# EAGLE design RX (EAGLE 7.3.0)
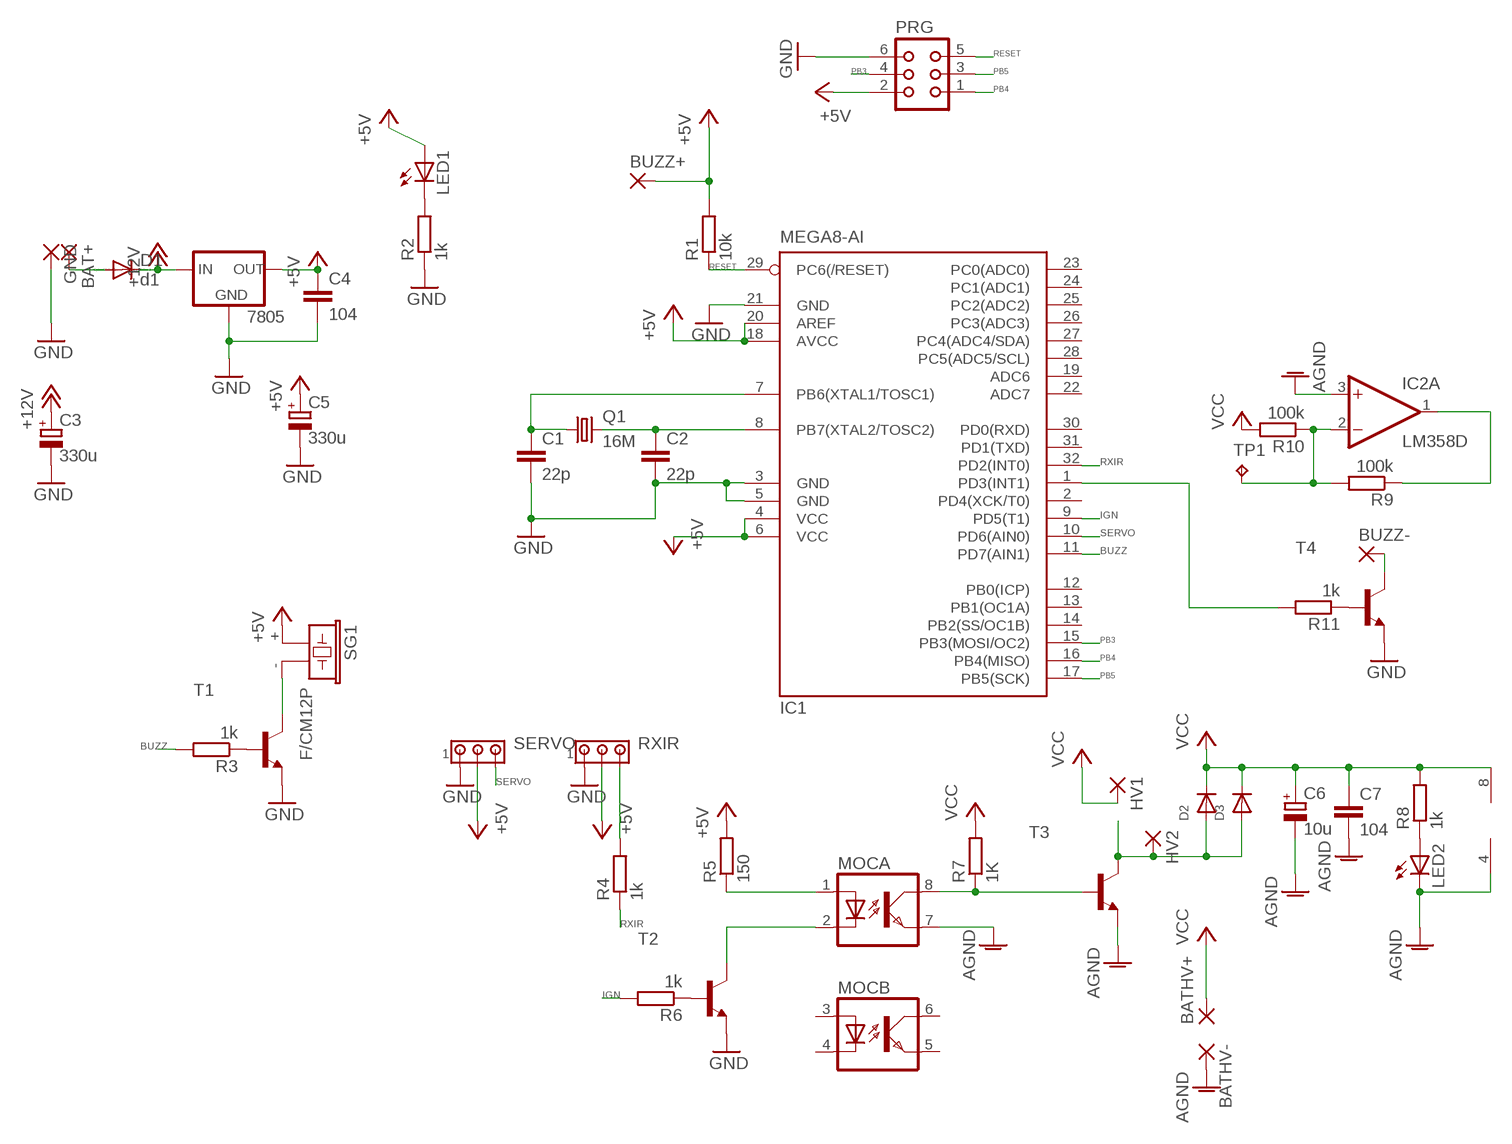
[diagram p0: schematic, sheet 1]

## Parts
7805  78LXX  [78LXX]
BAT+  SMD5  [SMD2,54-5,08]
BATHV+  SMD5  [SMD2,54-5,08]
BATHV-  SMD5  [SMD2,54-5,08]
BUZZ+  SMD2  [SMD1,27-2,54]
BUZZ-  SMD2  [SMD1,27-2,54]
C1  22p  C-EUC0805  [C0805]
C2  22p  C-EUC0805  [C0805]
C3  330u  CPOL-EU140CLH-1010  [140CLH-1010]
C4  104  C-EUC0805  [C0805]
C5  330u  CPOL-EU140CLH-1010  [140CLH-1010]
C6  10u  CPOL-EU140CLH-0810  [140CLH-0810]
C7  104  C-EUC0805  [C0805]
D1  d1  CGRM4007-G  [SOD-123_MINI-SMA]
D2  DIODE_SOD-123FL  [SOD-123FL]
D3  DIODE_SOD-123FL  [SOD-123FL]
GND  SMD5  [SMD2,54-5,08]
HV1  SMD5  [SMD2,54-5,08]
HV2  SMD5  [SMD2,54-5,08]
IC1  MEGA8-AI  [TQFP32-08]
IC2  LM358D  [SO08]
LED1  LED3MM  [LED3MM]
LED2  LEDCHIPLED_0805  [CHIPLED_0805]
MOC  MOCD207M  [SOIC08-FAIRCHILD]
PRG  CON06  [CON06]
Q1  16M  CRYSTALHC49UP  [HC49UP]
R1  10k  R-EU_M1206  [M1206]
R2  1k  R-EU_M1206  [M1206]
R3  1k  R-EU_M1206  [M1206]
R4  1k  R-EU_M1206  [M1206]
R5  150  R-EU_M1206  [M1206]
R6  1k  R-EU_M1206  [M1206]
R7  1K  R-EU_M1206  [M1206]
R8  1k  R-EU_M1206  [M1206]
R9  100k  R-EU_M1206  [M1206]
R10  100k  R-EU_M1206  [M1206]
R11  1k  R-EU_M1206  [M1206]
RXIR  MTA03-100  [10X03MTA]
SERVO  MTA03-100  [10X03MTA]
SG1  F/CM12P  [F/CM12P]
T1  MMBT2222ALT1-NPN-SOT23-BEC  [SOT23-BEC]
T2  MMBT2222ALT1-NPN-SOT23-BEC  [SOT23-BEC]
T3  MMBT2222ALT1-NPN-SOT23-BEC  [SOT23-BEC]
T4  MMBT2222ALT1-NPN-SOT23-BEC  [SOT23-BEC]
TP1  TPTP10R  [TP10R]

## Nets
+5V: 7805.OUT BUZZ+.1(P) C4.1 C5.+ IC1.4(VCC) IC1.6(VCC) IC1.18(AVCC) IC1.20(AREF) LED1.A PRG.2 R1.2 R5.2 RXIR.2 SERVO.2 SG1.+
+12V: 7805.IN C3.+ D1.C
AGND: BATHV-.1(P) C6.- C7.2 IC2.3(A:+IN) IC2.4(P:V-) LED2.C MOC.7(A:EMIT) T3.E
BUZZ: IC1.11(PD7(AIN1)) R3.2
GND: 7805.GND C1.2 C2.2 C3.- C4.2 C5.- GND.1(P) IC1.3(GND) IC1.5(GND) IC1.21(GND) PRG.6 R2.1 RXIR.1 SERVO.1 T1.E T2.E T4.E
IGN: IC1.9(PD5(T1)) R6.2
N$1: C2.1 IC1.8(PB7(XTAL2/TOSC2)) Q1.2
N$2: C1.1 IC1.7(PB6(XTAL1/TOSC1)) Q1.1
N$3: BAT+.1(P) D1.A
N$4: R11.1 T4.B
N$5: SG1.- T1.C
N$6: LED1.K(C) R2.2
N$7: R3.1 T1.B
N$8: R4.2 RXIR.3
N$9: MOC.2(A:C) T2.C
N$10: MOC.1(A:A) R5.1
N$11: R6.1 T2.B
N$12: MOC.8(A:COL) R7.1 T3.B
N$13: D2.A D3.A HV2.1(P) T3.C
N$14: LED2.A R8.1
N$15: IC2.2(A:-IN) R9.2 R10.1 TP1.TP
N$16: IC2.1(A:OUT) R9.1
N$17: IC1.1(PD3(INT1)) R11.2
N$18: BUZZ-.1(P) T4.C
PB3: IC1.15(PB3(MOSI/OC2)) PRG.4
PB4: IC1.16(PB4(MISO)) PRG.1
PB5: IC1.17(PB5(SCK)) PRG.3
RESET: IC1.29(PC6(/RESET)) PRG.5 R1.1
RXIR: IC1.32(PD2(INT0)) R4.1
SERVO: IC1.10(PD6(AIN0)) SERVO.3
VCC: BATHV+.1(P) C6.+ C7.1 D2.C D3.C HV1.1(P) IC2.8(P:V+) R7.2 R8.2 R10.2
Unconnected: IC1.2(PD4(XCK/T0)) IC1.12(PB0(ICP)) IC1.13(PB1(OC1A)) IC1.14(PB2(SS/OC1B)) IC1.19(ADC6) IC1.22(ADC7) IC1.23(PC0(ADC0)) IC1.24(PC1(ADC1)) IC1.25(PC2(ADC2)) IC1.26(PC3(ADC3)) IC1.27(PC4(ADC4/SDA)) IC1.28(PC5(ADC5/SCL)) IC1.30(PD0(RXD)) IC1.31(PD1(TXD)) IC2.5(B:+IN) IC2.6(B:-IN) IC2.7(B:OUT) MOC.3(B:A) MOC.4(B:C) MOC.5(B:EMIT) MOC.6(B:COL)

## Library data of the parts
7805 = v-reg:78LXX: VOLTAGE REGULATOR
BAT+ BATHV+ BATHV- GND HV1 HV2 = wirepad:SMD5: SMD PAD
BUZZ+ BUZZ- = wirepad:SMD2: SMD PAD
C1 C2 C4 C7 = rcl:C-EU: CAPACITOR, European symbol
C3 C5 C6 = rcl:CPOL-EU: POLARIZED CAPACITOR, European symbol
D1 = diode:CGRM400*-G: Molded plasitc,JEDEC SOD-123/Mini SMA Source: Comchip CGRM4001-G.pdf
D2 D3 = adafruit:DIODE: Diode SMADIODE - SMA Surface Mount Package 20V 1A Schottky Diode Digikey: 641-1014-6-ND DO-1N4148 - Through Hole Small Current Diode SOD-123 20V 1 A (.5mV Vf) Schottky Diode - Digikey: MBRX120TPMSCT-ND SOD-323 10V 570mA (.38mV Vf, 3ns) Schottky Diode - Digikey: ZLLS410CT-ND SOD-523 30V 30mA Schottky Diode (RB751S-40TE61) - Digikey: RB751S-40TE61CT-ND SOT23-R/W - SOT23 Package (R = Solder Paste/Reflow Ovens, W = Hand-Soldering) BAT54Film 40V 300mA - Digikey: 497-7162-1-ND
IC1 = atmel:MEGA8: MICROCONTROLLER 8 Kbytes FLASH, 1 kbytes SRAM, 512 bytes EEPROM, USART, 6-channel 10 bit ADC, 2-channel 8 bit ADC Pin compatible with Atmega48, ATMega88, ATMega168 Source: avr.lbr; MPN: ATMEGA8-16AU; OC_FARNELL: 9171371; OC_NEWARK: 73M8863
IC2 = linear:LM358: OP AMP also LM158; LM258; LM2904 Source: http://cache.national.com/ds/LM/LM158.pdf
LED1 LED2 = led:LED: LED OSRAM: - CHIPLED LG R971, LG N971, LY N971, LG Q971, LY Q971, LO R971, LY R971 LH N974, LH R974 LS Q976, LO Q976, LY Q976 LO Q996 - Hyper CHIPLED LW Q18S LB Q993, LB Q99A, LB R99A - SideLED LS A670, LO A670, LY A670, LG A670, LP A670 LB A673, LV A673, LT A673, LW A673 LH A674 LY A675 LS A676, LA A676, LO A676, LY A676, LW A676 LS A679, LY A679, LG A679 - Hyper Micro SIDELED® LS Y876, LA Y876, LO Y876, LY Y876 LT Y87S - SmartLED LW L88C, LW L88S LB L89C, LB L89S, LG L890 LS L89K, LO L89K, LY L89K LS L896, LA L896, LO L896, LY L896 - TOPLED LS T670, LO T670, LY T670, LG T670, LP T670 LSG T670, LSP T670, LSY T670, LOP T670, LYG T670 LG T671, LOG T671, LSG T671 LB T673, LV T673, LT T673, LW T673 LH T674 LS T676, LA T676, LO T676, LY T676, LB T676, LH T676, LSB T676, LW T676 LB T67C, LV T67C, LT T67C, LS T67K, LO T67K, LY T67K, LW E67C LS E67B, LA E67B, LO E67B, LY E67B, LB E67C, LV E67C, LT E67C LW T67C LS T679, LY T679, LG T679 LS T770, LO T770, LY T770, LG T770, LP T770 LB T773, LV T773, LT T773, LW T773 LH T774 LS E675, LA E675, LY E675, LS T675 LS T776, LA T776, LO T776, LY T776, LB T776 LHGB T686 LT T68C, LB T68C - Hyper Mini TOPLED® LB M676 - Mini TOPLED Santana® LG M470 LS M47K, LO M47K, LY M47K Source: http://www.osram.convergy.de LUXEON: - LUMILED® LXK2-PW12-R00, LXK2-PW12-S00, LXK2-PW14-U00, LXK2-PW14-V00 LXK2-PM12-R00, LXK2-PM12-S00, LXK2-PM14-U00 LXK2-PE12-Q00, LXK2-PE12-R00, LXK2-PE12-S00, LXK2-PE14-T00, LXK2-PE14-U00 LXK2-PB12-K00, LXK2-PB12-L00, LXK2-PB12-M00, LXK2-PB14-N00, LXK2-PB14-P00, LXK2-PB14-Q00 LXK2-PR12-L00, LXK2-PR12-M00, LXK2-PR14-Q00, LXK2-PR14-R00 LXK2-PD12-Q00, LXK2-PD12-R00, LXK2-PD12-S00 LXK2-PH12-R00, LXK2-PH12-S00 LXK2-PL12-P00, LXK2-PL12-Q00, LXK2-PL12-R00 Source: www.luxeon.com KINGBRIGHT: KA-3528ASYC Source: www.kingbright.com
MOC = optocoupler:MOCD20*M: MOCD207M, MOCD208M Dual Channel Phototransistor Small Outline Surface Mount Optocouplers Source: Data sheet <http://www.fairchildsemi.com/ds/MO%2FMOCD207-M.pdf>; MF: FAIRCHILD SEMICONDUCTOR; MPN: MOCD207-M; OC_FARNELL: 1623297; OC_NEWARK: 67K0803
PRG = con-harting:CON06: CONNECTOR; OC_FARNELL: unknown; OC_NEWARK: unknown
Q1 = crystal:CRYSTAL: CRYSTAL; OC_FARNELL: unknown; OC_NEWARK: unknown
R1-R11 = rcl:R-EU_: RESISTOR, European symbol
RXIR SERVO = con-amp:MTA03-100: AMP connector
SG1 = buzzer:F/CM12P: BUZZER Source: Buerklin; OC_FARNELL: unknown; OC_NEWARK: unknown
T1-T4 = transistor-neu-to92:*-NPN-: NPN Transistror
TP1 = testpad:TP: Test pad

## Board
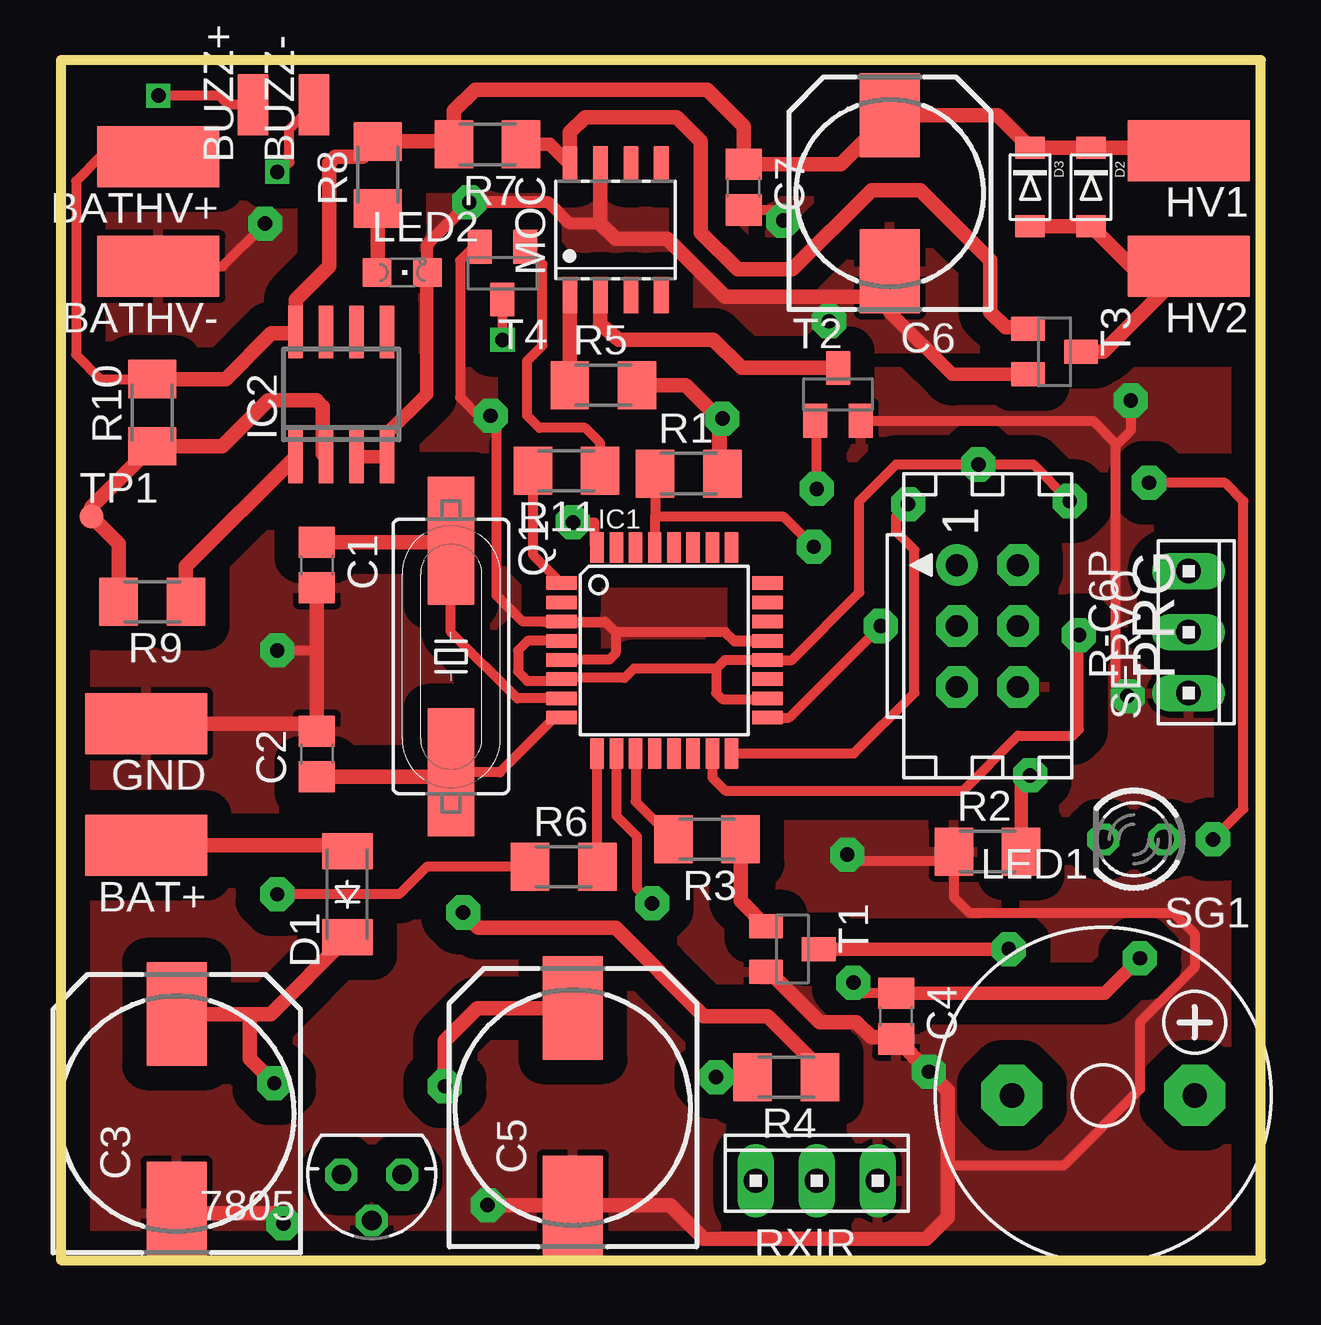
[diagram p1: board, top side]
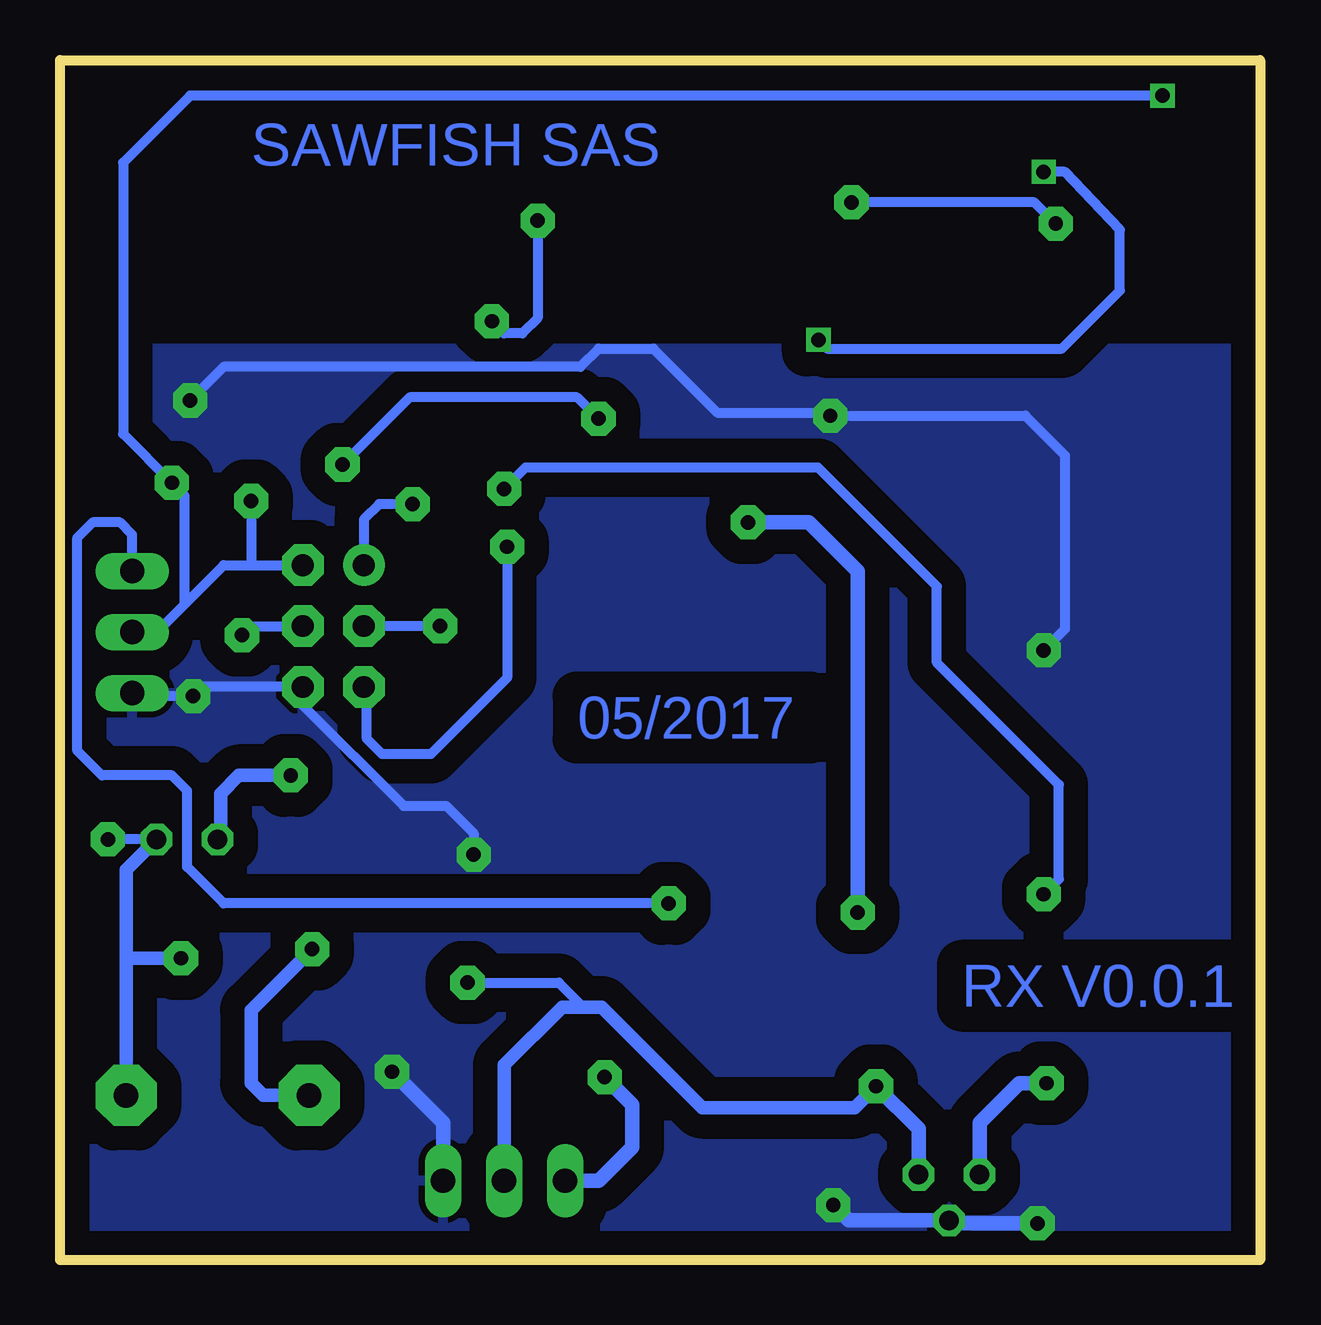
[diagram p2: board, bottom side, seen from below]

Size 50 x 50 mm. Coordinates in mm from the lower left corner, seen from the top.
Outline: 0,0 50,0 50,50 0,50 0,0
Copper layers (1*16): Top 0.035mm / dielectric 1.5mm / Bottom 0.035mm
Design rules "default": minimum track width 10mil, minimum drill 24mil, track to track 8mil, track to pad 8mil, pad to pad 8mil, via to via 8mil, smd to smd 8mil, copper to edge 40mil, drill to drill 8mil, minimum pad ring 10mil, minimum via ring 8mil, stop-mask expansion 4mil, vias tented up to drill 0mil, thermal gap 10mil

### Footprints (pad centres in the part's own frame; a part is rotated, then mirrored left to right if it is on the bottom)
78LXX = drill 0.813 octagon: GND 0,1.905; IN 1.27,0; OUT -1.27,0
SMD2,54-5,08 = smd 2.54 x 5.08: 1 0,0
SMD1,27-2,54 = smd 1.27 x 2.54: 1 0,0
C0805 = smd 1.3 x 1.5: 1 -0.95,0; 2 0.95,0
140CLH-1010 = smd 4.3 x 2.5: + 4.15,0; - -4.15,0
140CLH-0810 = smd 3.5 x 2.5: + 3.25,0; - -3.25,0
SOD-123_MINI-SMA = smd 1.5 x 2.1: A 1.8,0; C -1.8,0
SOD-123FL = smd 0.91 x 1.22: A 1.637,0; C -1.637,0
TQFP32-08 = smd 1.27 x 0.559: 1 -4.293,2.8; 2 -4.293,2; 3 -4.293,1.2; 4 -4.293,0.4; 5 -4.293,-0.4; 6 -4.293,-1.2; 7 -4.293,-2; 8 -4.293,-2.8; 17 4.293,-2.8; 18 4.293,-2; 19 4.293,-1.2; 20 4.293,-0.4; 21 4.293,0.4; 22 4.293,1.2; 23 4.293,2; 24 4.293,2.8 | smd 0.559 x 1.27: 9 -2.8,-4.293; 10 -2,-4.293; 11 -1.2,-4.293; 12 -0.4,-4.293; 13 0.4,-4.293; 14 1.2,-4.293; 15 2,-4.293; 16 2.8,-4.293; 25 2.8,4.293; 26 2,4.293; 27 1.2,4.293; 28 0.4,4.293; 29 -0.4,4.293; 30 -1.2,4.293; 31 -2,4.293; 32 -2.8,4.293
SO08 = smd 0.6 x 2.2: 1 -1.905,-2.6; 2 -0.635,-2.6; 3 0.635,-2.6; 4 1.905,-2.6; 5 1.905,2.6; 6 0.635,2.6; 7 -0.635,2.6; 8 -1.905,2.6
LED3MM = drill 0.813 octagon: A -1.27,0; K 1.27,0
CHIPLED_0805 = smd 1.2 x 1.2: A 0,-1.05; C 0,1.05
SOIC08-FAIRCHILD = smd 0.61 x 1.52: 1 -1.905,-2.723; 2 -0.635,-2.723; 3 0.635,-2.723; 4 1.905,-2.723; 5 1.905,2.723; 6 0.635,2.723; 7 -0.635,2.723; 8 -1.905,2.723
CON06 = drill 0.914 pad 1.727: 1 -2.54,-1.27 | drill 0.914 pad 1.727 octagon: 2 -2.54,1.27; 3 0,-1.27; 4 0,1.27; 5 2.54,-1.27; 6 2.54,1.27
HC49UP = smd 5.334 x 1.93: 1 -4.826,0; 2 4.826,0
M1206 = smd 1.6 x 2: 1 -1.4,0; 2 1.4,0
10X03MTA = drill 1.016 long: 1 2.54,0; 2 0,0; 3 -2.54,0
F/CM12P = drill 1.016 pad 2.54 octagon: + 3.81,0; - -3.81,0
SOT23-BEC = smd 1 x 1.4: B -0.95,-1.1; C 0,1.1; E 0.95,-1.1
TP10R = smd 1 x 1: TP 0,0

### Placement (x,y rotation side)
7805  12.95,3.56 180 top
BAT+  3.56,17.27 90 top
BATHV+  4.06,45.97 90 top
BATHV-  4.06,41.4 90 top
BUZZ+  8,48.13 0 top
BUZZ-  10.54,48.13 0 top
C1  10.67,28.96 270 top
C2  10.67,21.08 90 top
C3  4.83,6.1 90 top
C4  34.8,10.16 270 top
C5  21.34,6.35 90 top
C6  34.54,44.45 90 top
C7  28.45,44.7 270 top
D1  11.94,15.24 90 top
D2  42.93,44.7 270 top
D3  40.39,44.7 270 top
GND  3.56,22.35 90 top
HV1  46.99,46.23 90 top
HV2  46.99,41.4 90 top
IC1  25.15,25.4 0 top
IC2  11.68,36.07 0 top
LED1  44.7,17.53 180 top
LED2  14.22,41.15 270 top
MOC  23.11,42.93 0 top
PRG  38.61,26.42 270 top
Q1  16.26,25.15 270 top
R1  26.16,32.77 0 top
R2  38.61,17.02 0 top
R3  26.92,17.53 180 top
R4  30.23,7.62 180 top
R5  22.61,36.45 0 top
R6  20.95,16.38 0 top
R7  17.78,46.48 180 top
R8  13.21,45.21 90 top
R9  3.81,27.43 180 top
R10  3.81,35.31 90 top
R11  21.07,32.89 180 top
RXIR  31.5,3.3 0 top
SERVO  46.99,26.16 270 top
SG1  43.43,6.86 0 top
T1  30.48,12.95 270 top
T2  32.38,36.07 0 top
T3  41.4,37.85 270 top
T4  18.4,41.12 180 top
TP1  1.27,30.99 0 top

### Tracks (layer width: path | path; a pad name or v marks a point on that pad's centre or on a via)
+5V  (via drill 0.6, 0.6 pad 1.42)
  Top 0.406: IC1.4 19.45,25.8 19.05,25.4 19.05,24.51 19.43,24.13 20.78,24.13 IC1.6 20.91,24.26 23.5,24.26 23.88,24.64 27.3,24.64 | 27.3,24.64 27.67,25 IC1.20 30.46,25 33.27,27.81 33.27,31.62 34.8,33.15 v38.23,33.15 40.51,33.15 v42.04,31.62 | 27.3,24.64 27.3,23.62 27.56,23.37 29.41,23.37 IC1.18 | R1.2 v27.56,35.05 | C4.1 33.47,11.11 v33.02,11.56 | v48.01,17.53 49.28,18.8 49.28,31.62 48.51,32.38 v45.34,32.38 | BUZZ+.1 6.99,48.13 6.6,48.51 v4.06,48.51
  Top 0.559: C4.1 43.49,11.11 v44.96,12.57
  Top 0.61: R5.2 26.04,36.45 27.43,35.05 27.43,32.9 R1.2 | C5.+ 17.36,10.5 16,9.14 v16,7.24
  Bottom 0.406: SERVO.2 45.97,26.16 44.83,27.3 | 44.83,27.3 43.18,28.96 42.16,28.96 | 42.16,28.96 PRG.2 | v42.04,31.62 42.04,29.08 42.16,28.96 | v27.56,35.05 28.45,35.94 35.43,35.94 v38.23,33.15 | v33.02,11.56 29.21,11.56 28.19,10.54 | LED1.A v48.01,17.53 | 44.83,27.3 44.83,31.88 v45.34,32.38 47.37,34.42 47.37,45.72 44.58,48.51 v4.06,48.51
  Bottom 0.559: RXIR.2 31.5,8.13 29.08,10.54 28.19,10.54 27.43,10.54 23.24,6.35 16.89,6.35 v16,7.24 | SG1.+ 47.24,12.45 | 47.24,12.45 47.24,16.26 LED1.A | v44.96,12.57 47.12,12.57 47.24,12.45
  Bottom 0.61: v16,7.24 14.22,5.46 7805.OUT
+12V  (via drill 0.6 pad 1.42)
  Top 0.61: C3.+ 7.87,10.25 | 7.87,10.25 8.74,10.25 D1.C | v8.89,7.37 7.87,8.38 7.87,10.25
  Bottom 0.61: 7805.IN 11.68,5.71 10.03,7.37 v8.89,7.37
AGND  (via drill 0.6 pad 1.42)
  Top 0.406: BATHV-.1 6.73,41.4 v8.51,43.18 | C7.2 29.65,43.75 v30.1,43.31 | v32,39.12 32,40.13
  Top 0.508: LED2.C 15.27,42.33 v17.02,44.07 20.32,44.07 21.21,43.18 22.48,43.18
  Top 0.559: T3.E 37.15,36.9 34.54,39.5 C6.- | IC2.3 IC2.4 13.59,34.42 15.24,36.07 15.24,41.11 LED2.C
  Top 0.61: 22.48,43.94 MOC.7 22.48,43.18 23.11,42.55 25.27,42.55 27.69,40.13 32,40.13 33.48,40.13 C6.-
  Bottom 0.406: v8.51,43.18 9.4,44.07 v17.02,44.07 | v30.1,43.31 30.1,39.24 30.73,38.61 31.5,38.61 v32,39.12
  pour Top (isolate 1.016): -2,51 -2,38 54,38 54,52 -2,52
BUZZ
  Top 0.406: IC1.11 23.95,19.1 R3.2
GND  (via drill 0.6 pad 1.42)
  Top 0.406: 22.73,26.54 22.68,26.6 IC1.3 19.25,26.6 | 23.11,26.16 23.11,25.27 22.86,25.02 20.87,25.02 IC1.5 | 28.05,25.8 28.07,25.78 29.42,25.78 IC1.21 28.05,25.8 | v9.02,25.4 10.67,25.4 | T2.E 43.01,34.97 43.94,34.04 43.94,33.91 | 43.94,33.91 43.94,24 v44.45,23.5 | v32.77,16.89 33.02,16.64 36.83,16.64 R2.1 37.21,15.12 37.85,14.48 46.35,14.48 47.24,13.59 47.24,12.19 44.96,9.91 44.96,7.11 41.78,3.94 36.96,3.94 | 28.05,25.8 27.69,26.16 23.11,26.16 | 23.11,26.16 22.73,26.54 | 22.73,26.54 20.95,26.54 19.25,26.6 | 19.25,26.6 18.16,27.69 18.16,34.92 v17.91,35.18 17.4,35.18 16.64,35.94 16.64,41.66 17.2,42.22 T4.E | v44.58,35.81 44.58,34.54 43.94,33.91
  Top 0.61: C1.2 10.67,25.4 C2.2 10.35,22.35 GND.1 | T1.E 29.52,12 31.62,9.91 33.15,9.91 33.78,9.27 34.74,9.27 C4.2 v36.16,7.84 36.96,7.05 36.96,3.94 36.96,1.78 36.07,0.89 26.8,0.89 25.4,2.29 21.25,2.29 | C3.- 8.85,1.95 v9.27,1.52 | v17.78,2.29 21.25,2.29 | 21.25,2.29 C5.-
  Bottom 0.406: v9.02,25.4 8.13,26.29 8.13,33.53 9.78,35.18 v17.91,35.18 18.03,35.31 22.61,35.31 25.27,37.97 27.56,37.97 28.32,37.21 43.18,37.21 v44.58,35.81 | SERVO.1 46.86,23.5 v44.45,23.5 44.07,23.88 PRG.6 39.88,23.11 35.69,18.92 33.91,18.92 32.77,17.78 v32.77,16.89
  Bottom 0.61: v9.27,1.52 12.83,1.52 7805.GND 17.14,1.65 v17.78,2.29 | RXIR.1 34.04,5.71 v36.16,7.84
  pour Bottom (isolate 1.016): -2,36 -2,-3 52,-3 52,38 -2,38
  pour Top (isolate 1.016): -2,36 -2,-1 52,-1 52,37 -2,37
IGN
  Top 0.406: R6.2 22.36,21.1 IC1.9
N$1
  Top 0.406: IC1.8 20.57,22.6 18.29,20.32 Q1.2
  Top 0.61: C2.1 16.07,20.13 Q1.2
N$2
  Top 0.406: IC1.7 19.02,23.4 16.26,26.16 16.26,27.94
  Top 0.61: 16.26,27.94 16,28.19 16,29.72 Q1.1 16.19,29.91 C1.1
N$3
  Top 0.61: BAT+.1 11.71,17.27 D1.A
N$4
  Top 0.406: R11.1 22.46,34.05 21.84,34.67 19.94,34.67 19.43,35.18 19.43,37.47 20.07,38.1 20.07,41.5 T4.B
N$5  (via drill 0.6 pad 1.42)
  Top 0.559: T1.C v39.5,12.95
  Bottom 0.559: v39.5,12.95 42.04,10.41 42.04,7.37 41.53,6.86 SG1.-
N$6  (via drill 0.6 pad 1.42)
  Top 0.559: R2.2 40.01,19.82 v40.39,20.19
  Bottom 0.559: v40.39,20.19 42.55,20.19 43.31,19.43 43.31,17.65 LED1.K
N$7
  Top 0.61: R3.1 28.32,14.96 T1.B
N$8  (via drill 0.6 pad 1.42)
  Top 0.61: R4.2 v27.3,7.62
  Bottom 0.61: v27.3,7.62 26.16,6.48 26.16,4.7 27.56,3.3 RXIR.3
N$9
  Top 0.61: T2.C 28.36,37.17 27.18,38.35 23.24,38.35 22.48,38.99 MOC.2
N$10
  Top 0.61: MOC.1 21.21,37.09 R5.1
N$11  (via drill 0.6 pad 1.42)
  Top 0.406: R6.1 15.24,16.38 14.1,15.24 v9.02,15.24 | v31.5,32.13 31.5,34.91 T2.B
  Bottom 0.406: v9.02,15.24 8.38,15.88 8.38,19.81 13.46,24.89 13.46,28.07 18.41,33.02 30.61,33.02 v31.5,32.13
N$12
  Top 0.559: R7.1 20.38,46.48 MOC.8
  Top 0.61: MOC.8 21.21,46.99 21.84,47.62 25.65,47.62 26.67,46.61 26.67,42.8 28.19,41.27 30.48,41.27 33.78,44.58 35.81,44.58 38.73,41.66 38.73,39.5 39.37,38.86 40.24,38.86 T3.B
N$13
  Top 0.61: D3.A D2.A 44.59,41.4 HV2.1 43.43,37.85 T3.C
N$14
  Top 0.61: R8.1 13.21,41.18 LED2.A
N$15
  Top 0.61: IC2.2 10.92,33.59 10.92,35.56 10.67,35.81 8.64,35.81 6.73,33.91 R10.1 1.27,31.37 TP1.TP 2.41,29.85 R9.2
N$16
  Top 0.61: R9.1 5.21,28.9 IC2.1
N$17
  Top 0.406: R11.2 19.66,29.39 IC1.1
N$18  (via drill 0.6)
  Top 0.406: T4.C v18.4,38.34 | v9.02,45.34 9.53,45.72 9.53,47.12 BUZZ-.1
  Bottom 0.406: v18.4,38.34 18.03,37.97 8.26,37.97 5.84,40.39 5.84,42.93 8.13,45.34 v9.02,45.34
PB3  (via drill 0.6 pad 1.42)
  Top 0.406: IC1.15 27.15,20.1 27.69,19.56 37.59,19.56 39.88,21.84 42.16,21.84 42.42,22.1 v42.42,26.04
  Bottom 0.406: v42.42,26.04 42.04,26.42 PRG.4
PB4  (via drill 0.6 pad 1.42)
  Top 0.406: IC1.16 33.05,21.11 35.56,23.62 35.56,29.59 34.8,30.35 34.8,30.99 v35.31,31.5
  Bottom 0.406: v35.31,31.5 36.7,31.5 37.34,30.86 PRG.1
PB5  (via drill 0.6 pad 1.42)
  Top 0.406: IC1.17 30.35,22.6 v34.16,26.42
  Bottom 0.406: v34.16,26.42 PRG.3
RESET  (via drill 0.6 pad 1.42)
  Top 0.406: R1.1 24.76,30.98 | IC1.29 24.76,29.71 24.76,30.98 | 24.76,30.98 24.77,30.99 30.1,30.99 v31.37,29.72
  Bottom 0.406: v31.37,29.72 31.37,24.26 34.54,21.08 36.58,21.08 37.21,21.72 37.21,23.75 PRG.5
RXIR  (via drill 0.6 pad 1.42)
  Top 0.406: v21.34,30.73 22.23,30.73 22.23,29.81 IC1.32
  Top 0.61: R4.1 31.63,8 29.46,10.16 26.8,10.16 23.11,13.84 17.4,13.84 v16.76,14.48
  Bottom 0.61: v16.76,14.48 16.76,28.7 18.8,30.73 v21.34,30.73
SERVO  (via drill 0.6 pad 1.42)
  Top 0.406: IC1.10 23.15,18.51 24,17.65 24,15.49 v24.64,14.86
  Bottom 0.406: v24.64,14.86 43.18,14.86 44.7,16.38 44.7,19.56 45.34,20.19 48.26,20.19 49.28,21.21 49.28,30.1 48.64,30.73 47.5,30.73 46.99,30.23 SERVO.3
VCC
  Top 0.406: BATHV+.1 1.65,45.97 0.64,44.96 0.64,37.72 1.65,36.7 R10.2
  Top 0.61: HV1.1 46.88,46.34 D2.C D3.C 39.03,47.7 C6.+ 32.5,45.65 C7.1 28.45,47.24 26.92,48.77 17.27,48.77 16.38,47.88 R7.2 16.25,46.61 R8.2 12.57,45.97 11.43,45.97 11.18,45.72 11.18,41.4 9.78,40.01 IC2.8 9.72,38.61 8.76,38.61 6.86,36.71 R10.2

### Text on the board
Bottom: SAWFISH SAS | 05/2017 | RX V0.0.1